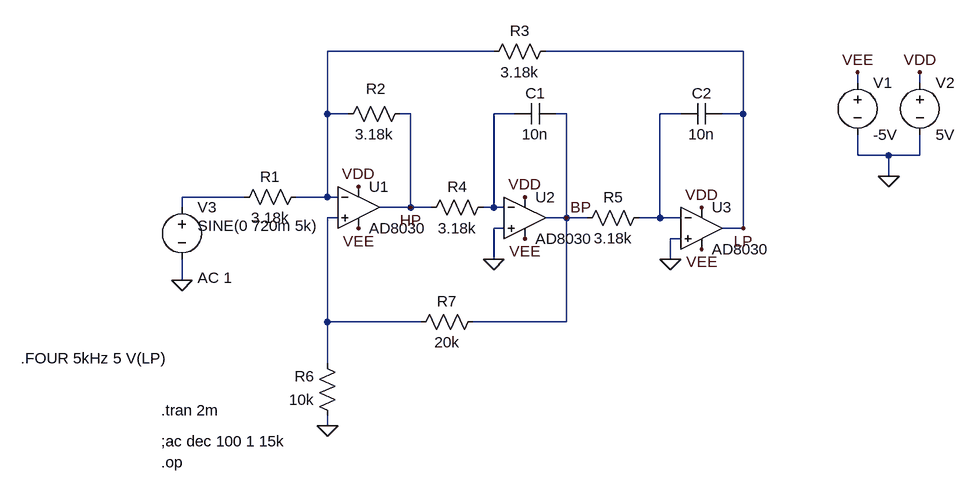
[diagram p0: schematic Etajul 2.asc]
Etajul 2.asc, the LTspice schematic file:
Version 4
SHEET 1 1064 680
WIRE 352 -64 96 -64
WIRE 736 -64 432 -64
WIRE 912 -16 912 -32
WIRE 1008 -16 1008 -32
WIRE 96 32 96 -64
WIRE 128 32 96 32
WIRE 224 32 208 32
WIRE 384 32 352 32
WIRE 464 32 448 32
WIRE 640 32 608 32
WIRE 736 32 736 -64
WIRE 736 32 704 32
WIRE 912 96 912 64
WIRE 960 96 912 96
WIRE 1008 96 1008 64
WIRE 1008 96 960 96
WIRE 960 128 960 96
WIRE -32 160 -128 160
WIRE 96 160 96 32
WIRE 96 160 48 160
WIRE 112 160 96 160
WIRE -128 176 -128 160
WIRE 224 176 224 32
WIRE 224 176 176 176
WIRE 256 176 224 176
WIRE 352 176 352 32
WIRE 352 176 336 176
WIRE 368 176 352 176
WIRE 112 192 96 192
WIRE 464 192 464 32
WIRE 464 192 432 192
WIRE 496 192 464 192
WIRE 608 192 608 32
WIRE 608 192 576 192
WIRE 640 192 608 192
WIRE 368 208 352 208
WIRE 736 208 736 32
WIRE 736 208 704 208
WIRE 640 224 624 224
WIRE 352 256 352 208
WIRE 624 256 624 224
WIRE -128 288 -128 256
WIRE 96 352 96 192
WIRE 240 352 96 352
WIRE 464 352 464 192
WIRE 464 352 320 352
WIRE 96 416 96 352
WIRE 96 512 96 496
FLAG 912 -32 VEE
FLAG 144 208 VEE
FLAG 400 224 VEE
FLAG 672 240 VEE
FLAG 1008 -32 VDD
FLAG 144 144 VDD
FLAG 400 160 VDD
FLAG 672 176 VDD
FLAG 96 512 0
FLAG 352 256 0
FLAG 624 256 0
FLAG 960 128 0
FLAG -128 288 0
FLAG 224 176 HP
FLAG 464 192 BP
FLAG 736 208 LP
SYMBOL res 64 144 R90
WINDOW 0 0 56 VBottom 2
WINDOW 3 32 56 VTop 2
SYMATTR InstName R1
SYMATTR Value 3.18k
SYMBOL res 224 16 R90
WINDOW 0 -7 53 VBottom 2
WINDOW 3 32 56 VTop 2
SYMATTR InstName R2
SYMATTR Value 3.18k
SYMBOL res 448 -80 R90
WINDOW 0 0 56 VBottom 2
WINDOW 3 32 56 VTop 2
SYMATTR InstName R3
SYMATTR Value 3.18k
SYMBOL res 112 512 R180
WINDOW 0 36 76 Left 2
WINDOW 3 36 40 Left 2
SYMATTR InstName R6
SYMATTR Value 10k
SYMBOL res 224 368 R270
WINDOW 0 32 56 VTop 2
WINDOW 3 0 56 VBottom 2
SYMATTR InstName R7
SYMATTR Value 20k
SYMBOL res 480 208 R270
WINDOW 0 32 56 VTop 2
WINDOW 3 0 56 VBottom 2
SYMATTR InstName R5
SYMATTR Value 3.18k
SYMBOL OpAmps\\AD8030 144 112 R0
SYMATTR InstName U1
SYMBOL OpAmps\\AD8030 400 128 R0
SYMATTR InstName U2
SYMBOL res 352 160 R90
WINDOW 0 0 56 VBottom 2
WINDOW 3 32 56 VTop 2
SYMATTR InstName R4
SYMATTR Value 3.18k
SYMBOL cap 448 16 R90
WINDOW 0 0 32 VBottom 2
WINDOW 3 32 32 VTop 2
SYMATTR InstName C1
SYMATTR Value 10n
SYMBOL cap 704 16 R90
WINDOW 0 0 32 VBottom 2
WINDOW 3 32 32 VTop 2
SYMATTR InstName C2
SYMATTR Value 10n
SYMBOL voltage 912 -32 R0
SYMATTR InstName V1
SYMATTR Value -5V
SYMBOL voltage 1008 -32 R0
SYMATTR InstName V2
SYMATTR Value 5V
SYMBOL voltage -128 160 R0
WINDOW 123 24 124 Left 2
WINDOW 39 0 0 Left 0
WINDOW 3 24 44 Left 2
SYMATTR Value2 AC 1
SYMATTR Value SINE(0 720m 5k)
SYMATTR InstName V3
SYMBOL OpAmps\\AD8030 672 144 R0
SYMATTR InstName U3
TEXT -160 536 Left 2 !;ac dec 100 1 15k
TEXT -160 568 Left 2 !.op
TEXT -160 488 Left 2 !.tran 2m
TEXT -376 408 Left 2 !.FOUR 5kHz 5 V(LP)

The netlist it stands for:
* Etajul 2.asc
R1 N001 N004 3.18k
R2 HP N001 3.18k
R3 LP N001 3.18k
R6 0 N005 10k
R7 N005 BP 20k
R5 BP N003 3.18k
XU1 N005 N001 VDD VEE HP AD8040  ; AD8030, pins In+ In- V+ V- OUT
XU2 0 N002 VDD VEE BP AD8040  ; AD8030, pins In+ In- V+ V- OUT
R4 N002 HP 3.18k
C1 BP N002 10n
C2 LP N003 10n
V1 VEE 0 -5V
V2 VDD 0 5V
V3 N004 0 SINE(0 720m 5k) AC 1
XU3 0 N003 VDD VEE LP AD8040  ; AD8030, pins In+ In- V+ V- OUT
;ac dec 100 1 15k
.op
.tran 2m
.FOUR 5kHz 5 V(LP)
.lib ADI.lib
.backanno
.end